# EAGLE schematic display (EAGLE 9.6.2)
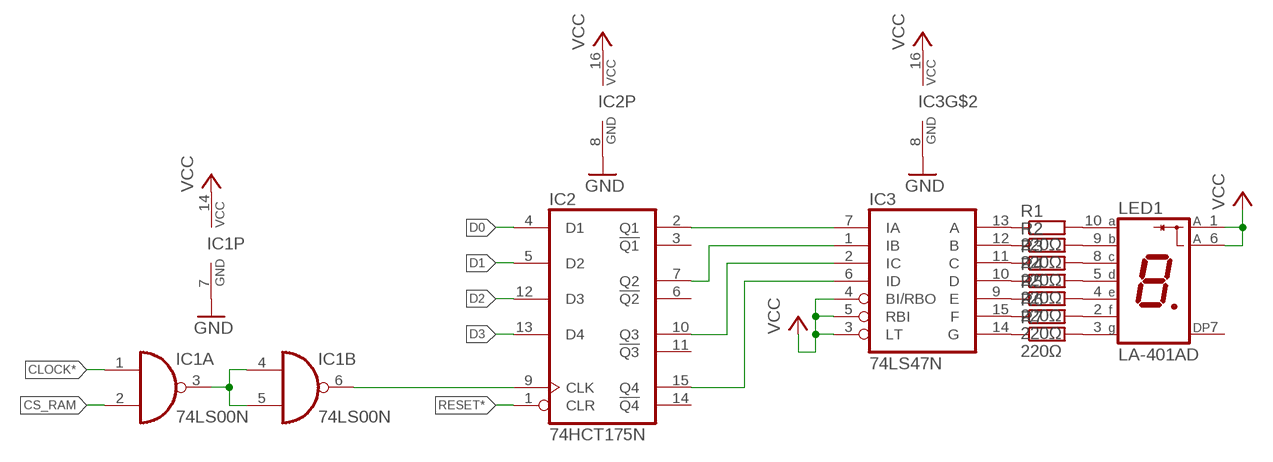
[diagram p0: schematic, sheet 1]

## Parts
IC1  74LS00N  [DIL14]
IC2  74HCT175N  [DIL16]
IC3  74LS47N  [DIL16]
LED1  LA-401AD  [LA-401]
R1  220Ω  R-EU_0207/10  [0207/10]
R2  220Ω  R-EU_0207/10  [0207/10]
R3  220Ω  R-EU_0207/10  [0207/10]
R4  220Ω  R-EU_0207/10  [0207/10]
R5  220Ω  R-EU_0207/10  [0207/10]
R6  220Ω  R-EU_0207/10  [0207/10]
R7  220Ω  R-EU_0207/10  [0207/10]

## Nets
CLOCK*: IC1.1(A:I0)
CS_RAM: IC1.2(A:I1)
D0: IC2.4(D1)
D1: IC2.5(D2)
D2: IC2.12(D3)
D3: IC2.13(D4)
GND: IC1.7(P:GND) IC2.8(GND) IC3.8(GND)
N$1: IC1.3(A:O) IC1.4(B:I0) IC1.5(B:I1)
N$2: IC1.6(B:O) IC2.9(CLK)
N$3: IC2.2(Q1) IC3.7(IA)
N$4: IC2.7(Q2) IC3.1(IB)
N$5: IC2.10(Q3) IC3.2(IC)
N$6: IC2.15(Q4) IC3.6(ID)
N$7: LED1.10(A) R1.2
N$8: LED1.9(B) R2.2
N$9: LED1.8(C) R3.2
N$10: LED1.5(D) R4.2
N$11: LED1.4(E) R5.2
N$12: LED1.2(F) R6.2
N$13: LED1.3(G) R7.2
N$14: IC3.13(A) R1.1
N$15: IC3.12(B) R2.1
N$16: IC3.11(C) R3.1
N$17: IC3.10(D) R4.1
N$18: IC3.9(E) R5.1
N$19: IC3.15(F) R6.1
N$20: IC3.14(G) R7.1
RESET*: IC2.1(CLR)
VCC: IC1.14(P:VCC) IC2.16(VCC) IC3.3(LT) IC3.4(BI/RBO) IC3.5(RBI) IC3.16(VCC) LED1.1(A) LED1.6(A)
Unconnected: IC1.8(C:O) IC1.9(C:I0) IC1.10(C:I1) IC1.11(D:O) IC1.12(D:I0) IC1.13(D:I1) IC2.3(!Q1) IC2.6(!Q2) IC2.11(!Q3) IC2.14(!Q4) LED1.7(DP)

## Library data of the parts
IC1 = 74xx-eu:74*00: Quad 2-input NAND gate
IC2 = 74xx-eu:74*175: Qadruple D type FLIP FLOP, clear
IC3 = 74xx-eu:74*47: BCD to seven segment DECODER/DRIVER Source: http://www.ee.washington.edu/stores/DataSheets/74ls/74ls47.pdf
LED1 = led-7-segment:LA-401*D: Single Digit LED Numeric Display (anode common) Source: ROHM .. la-1401dn.pdf; OC_FARNELL: unknown; OC_NEWARK: unknown
R1-R7 = rcl:R-EU_: RESISTOR, European symbol; SPICEPREFIX: R